# EAGLE schematic Breakout Board Schematic (EAGLE 9.7.0)
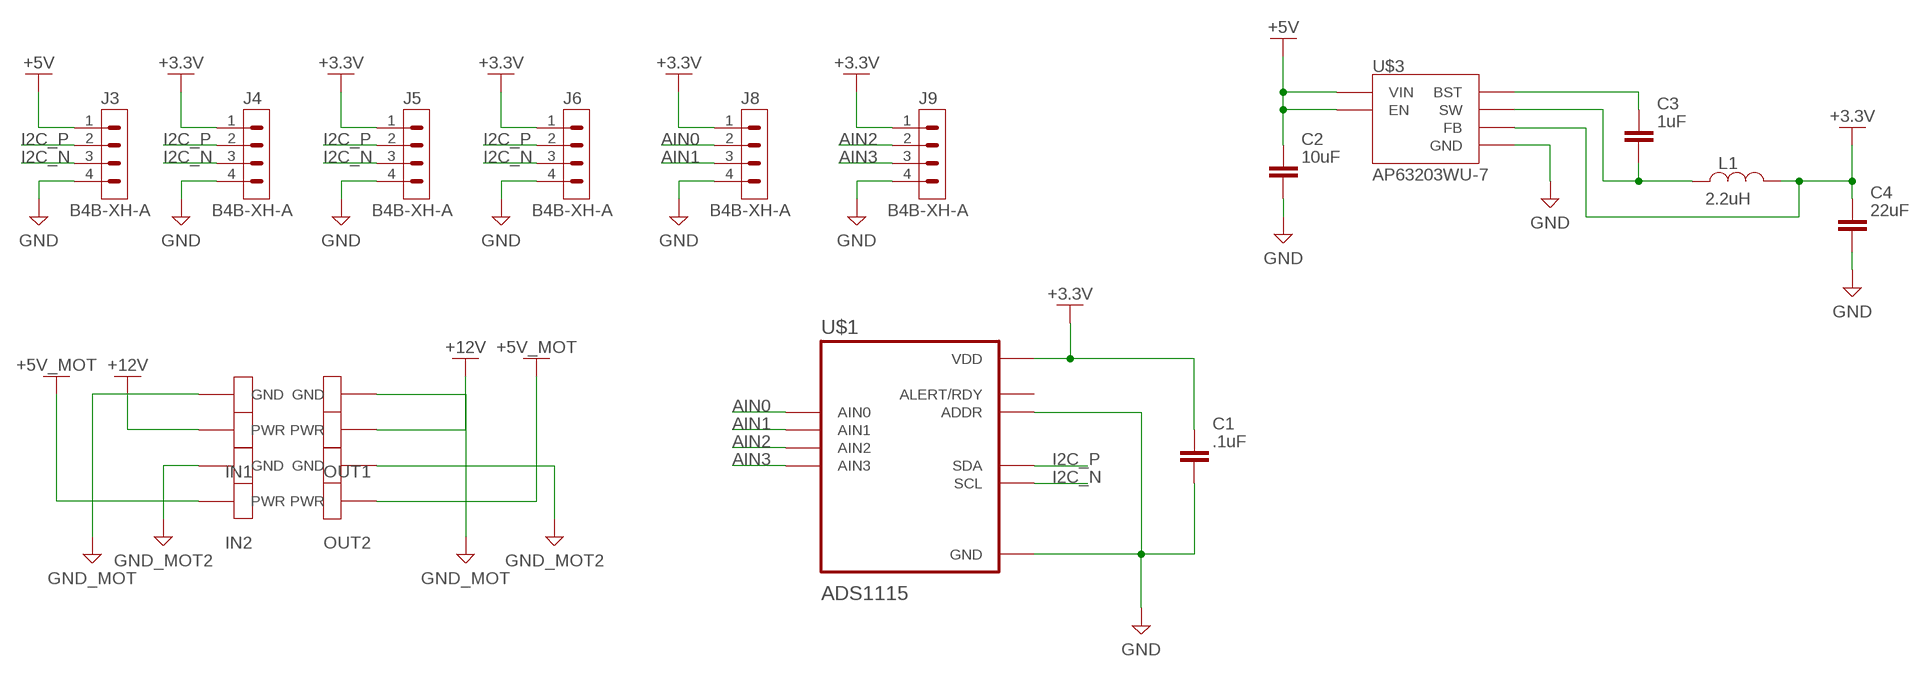
[diagram p0: schematic, sheet 1]

## Parts
C1  .1uF  C_CHIP-0805(2012-METRIC)  [CAPC2012X110]
C2  10uF  C_CHIP-0805(2012-METRIC)  [CAPC2012X110]
C3  1uF  C_CHIP-0805(2012-METRIC)  [CAPC2012X110]
C4  22uF  C_CHIP-0805(2012-METRIC)  [CAPC2012X110]
IN1  ANDERSONBOARDCONNECTORVERTICAL  [ANDERSONBOARDCONNECTORVERT]
IN2  ANDERSONBOARDCONNECTORVERTICAL  [ANDERSONBOARDCONNECTORVERT]
J3  B4B-XH-A  [B4B-XH-A]
J4  B4B-XH-A  [B4B-XH-A]
J5  B4B-XH-A  [B4B-XH-A]
J6  B4B-XH-A  [B4B-XH-A]
J8  B4B-XH-A  [B4B-XH-A]
J9  B4B-XH-A  [B4B-XH-A]
L1  2.2uH  L_MOLDED-1210(3225-METRIC)  [INDM3225X240]
OUT1  ANDERSONBOARDCONNECTORVERTICAL  [ANDERSONBOARDCONNECTORVERT]
OUT2  ANDERSONBOARDCONNECTORVERTICAL  [ANDERSONBOARDCONNECTORVERT]
U$1  ADS1115  [ADS1115]
U$3  AP63203WU-7  [AP63203WU-7]

## Nets
+3.3V: C1.1 C4.1 J4.1 J5.1 J6.1 J8.1 J9.1 L1.2 U$1.8(VDD) U$3.FB
+5V: C2.1 J3.1 U$3.EN U$3.VIN
+5V_MOT: IN2.PWR OUT2.PWR
+12V: IN1.PWR OUT1.PWR
AIN0: J8.2 U$1.4(AIN0)
AIN1: J8.3 U$1.5(AIN1)
AIN2: J9.2 U$1.6(AIN2)
AIN3: J9.3 U$1.7(AIN3)
BST: C3.1 U$3.BST
GND: C1.2 C2.2 C4.2 J3.4 J4.4 J5.4 J6.4 J8.4 J9.4 U$1.1(ADDR) U$1.3(GND) U$3.GND
GND_MOT: IN1.GND OUT1.GND
GND_MOT2: IN2.GND OUT2.GND
I2C_N: J3.3 J4.3 J5.3 J6.3 U$1.10(SCL)
I2C_P: J3.2 J4.2 J5.2 J6.2 U$1.9(SDA)
SW: C3.2 L1.1 U$3.SW
Unconnected: U$1.2(ALERT/RDY)

## Library data of the parts
C1-C4 = Capacitor:C: Capacitor - Generic; CATEGORY: Capacitor; PACKAGE_SIZE: 0805; PACKAGE_TYPE: SMD; SUBCATEGORY: Ceramic Capacitors; TYPE: MLCC
IN1 IN2 OUT1 OUT2 = CohenLibrary:ANDERSONBOARDCONNECTOR: https://www.digikey.com/en/products/detail/anderson-power-products-inc/1336G1/10650490
J3-J6 J8 J9 = Connector:B4B-XH-A: XH Connector Top Entry - 4POS Reference: Datasheet <http://www.jst-mfg.com/product/pdf/eng/eXH.pdf>; CATEGORY: Connectors; DATASHEET: https://www.jst-mfg.com/product/pdf/eng/eXH.pdf; DESCRIPTION: Connector Header Through Hole 4 position 0.098" (2.50mm); MANUFACTURER: JST Sales America Inc.; MPN: B4B-XH-A; OPERATING_TEMPERATURE: -25°C ~ 85°C; PACKAGE_SIZE: NA; PACKAGE_TYPE: Through Hole; PART_STATUS: Active; PITCH: 0.098" (2.50mm); ROHS: Compliant; SERIES: XH; SUBCATEGORY: Rectangular Connectors; TYPE: Male Headers
L1 = Inductor:L: Inductor Fixed - Generic; CATEGORY: Inductors; DESCRIPTION: Molded Body 3.20 X 2.50 X 2.40 mm body 1210(3225-METRIC); PACKAGE_SIZE: 1210; PACKAGE_TYPE: SMD
U$1 = CohenLibrary:ADS1115: https://www.digikey.com/en/products/detail/texas-instruments/ADS1115IDGSR/2231567
U$3 = CohenLibrary:AP63203WU-7: https://www.digikey.com/en/products/detail/diodes-incorporated/AP63203WU-7/9858426